# EAGLE schematic rip (EAGLE 7.6.0)
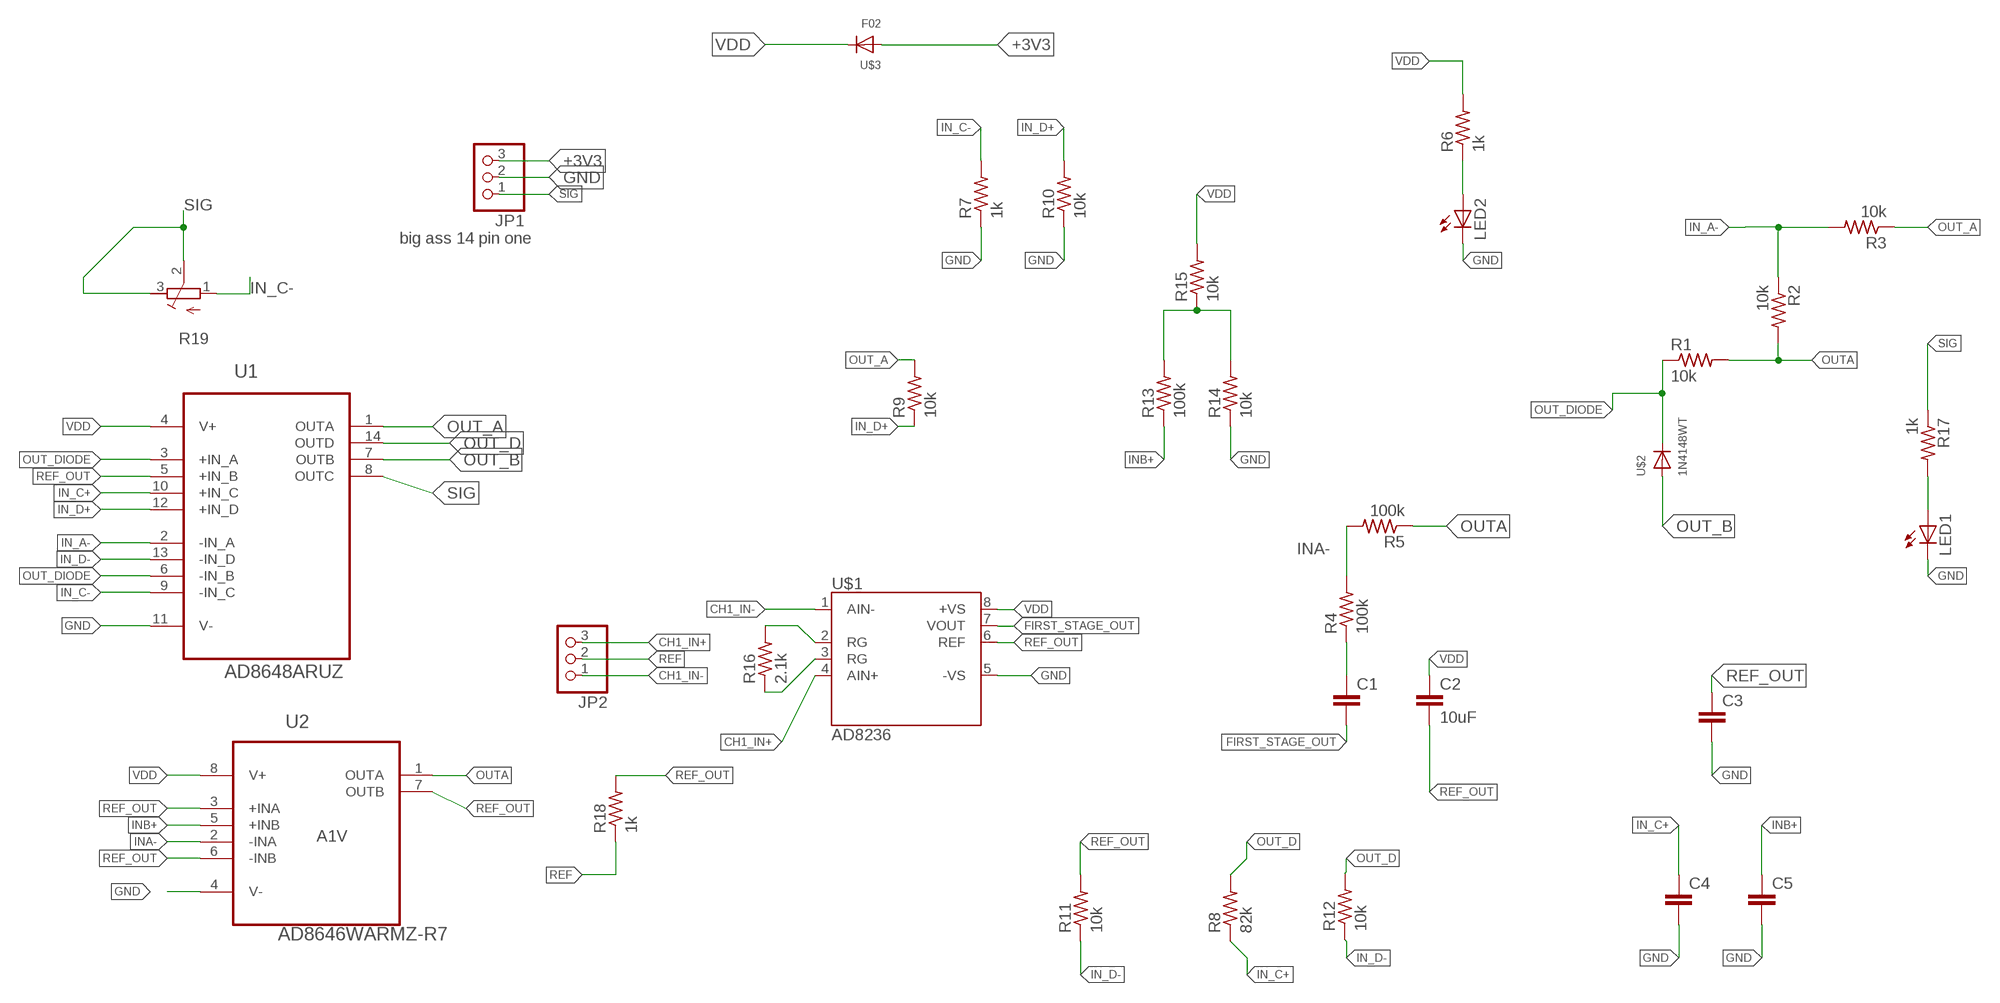
[diagram p0: schematic, sheet 1]

## Parts
C1  C-EUC0603  [C0603]
C2  10uF  C-EUC0603  [C0603]
C3  C-EUC0603  [C0603]
C4  C-EUC0603  [C0603]
C5  C-EUC0603  [C0603]
JP1  PINHD-1X3  [1X03]
JP2  PINHD-1X3  [1X03]
LED1  LED0603  [LED-0603]
LED2  LED0603  [LED-0603]
R1  10k  R-US_R0603  [R0603]
R2  10k  R-US_R0603  [R0603]
R3  10k  R-US_R0603  [R0603]
R4  100k  R-US_R0603  [R0603]
R5  100k  R-US_R0603  [R0603]
R6  1k  R-US_R0603  [R0603]
R7  1k  R-US_R0603  [R0603]
R8  82k  R-US_R0603  [R0603]
R9  10k  R-US_R0603  [R0603]
R10  10k  R-US_R0603  [R0603]
R11  10k  R-US_R0603  [R0603]
R12  10k  R-US_R0603  [R0603]
R13  100k  R-US_R0603  [R0603]
R14  10k  R-US_R0603  [R0603]
R15  10k  R-US_R0603  [R0603]
R16  2.1k  R-US_R0603  [R0603]
R17  1k  R-US_R0603  [R0603]
R18  1k  R-US_R0603  [R0603]
R19  R-TRIMM3103  [RTRIM3103]
U1  AD8648ARUZ  [SOP65P640X120-14N]
U2  AD8646WARMZ-R7  [SOP65P490X110-8N]
U$1  AD8236  [MSOP8]
U$2  1N4148WT  [SOD-523]
U$3  F02  [SOD-523]

## Nets
+3V3: JP1.3 U$3.A
CH1_IN+: JP2.3 U$1.4(AIN+)
CH1_IN-: JP2.1 U$1.1(AIN-)
FIRST_STAGE_OUT: C1.2 U$1.7(VOUT)
GND: C3.2 C4.2 C5.2 JP1.2 LED1.C LED2.C R7.1 R10.1 R14.1 U1.11(V-) U2.4(V-) U$1.5(-VS)
IN_A-: R2.1 R3.2 U1.2(-IN_A)
IN_C+: C4.1 R8.1 U1.10(+IN_C)
IN_C-: R7.2 R19.1(A) U1.9(-IN_C)
IN_D+: R9.1 R10.2 U1.12(+IN_D)
IN_D-: R11.1 R12.1 U1.13(-IN_D)
INA-: R4.2 R5.2 U2.2(-INA)
INB+: C5.1 R13.1 U2.5(+INB)
N$1: C1.1 R4.1
N$2: R13.2 R14.2 R15.1
N$3: LED1.A R17.2
N$4: LED2.A R6.1
N$11: R16.1 U$1.3(RG)
N$14: R16.2 U$1.2(RG)
OUT_A: R3.1 R9.2 U1.1(OUTA)
OUT_B: U1.7(OUTB) U$2.A
OUT_D: R8.2 R12.2 U1.14(OUTD)
OUT_DIODE: R1.1 U1.3(+IN_A) U1.6(-IN_B) U$2.K(C)
OUTA: R1.2 R2.2 R5.1 U2.1(OUTA)
REF: JP2.2 R18.1
REF_OUT: C2.2 C3.1 R11.2 R18.2 U1.5(+IN_B) U2.3(+INA) U2.6(-INB) U2.7(OUTB) U$1.6(REF)
SIG: JP1.1 R17.1 R19.2(S) R19.3(E) U1.8(OUTC)
VDD: C2.1 R6.2 R15.2 U1.4(V+) U2.8(V+) U$1.8(+VS) U$3.K(C)

## Notes on the sheet
- big ass 14 pin one
- A1V

## Library data of the parts
C1-C5 = rcl:C-EU: CAPACITOR, European symbol
JP1 JP2 = pinhead:PINHD-1X3: PIN HEADER
LED1 LED2 = SparkFun-LED:LED: LEDs Standard schematic elements and footprints for 5mm, 3mm, 1206, and 0603 sized LEDs. 5mm - Spark Fun Electronics SKU : COM-00529 (and others)
R1-R18 = rcl:R-US_: RESISTOR, American symbol
R19 = rcl:R-TRIMM: Trimm resistor
U1 = Analog Devices_By_element14_Batch_1:AD8648ARUZ: Rail-to-Rail Amplifiers; MPN: AD8648ARUZ; OC_FARNELL: 1274217; OC_NEWARK: 19M0988; PACKAGE: TSSOP-14; SUPPLIER: Analog Devices
U2 = Analog Devices_By_element14_Batch_1:AD8646WARMZ-R7: 24 MHz Rail-to-Rail Amplifiers with Shutdown Option; MPN: AD8646WARMZ-R7; OC_FARNELL: -; OC_NEWARK: 74R6010; PACKAGE: MSOP-8; SUPPLIER: Analog Devices
U$1 = SparkFun-AnalogIC:AD8236; DIGIKEY: AD8236ARMZ-R7CT-ND
U$2 = adafruit:1N4148WT; DIGIKEY: 1N4148WTCT-ND
U$3 = adafruit:F02